# EAGLE design ASL2002 (EAGLE 6.3)
DATABASE: ./../../../../../Components/TinyCircuits_Part_Database.txt
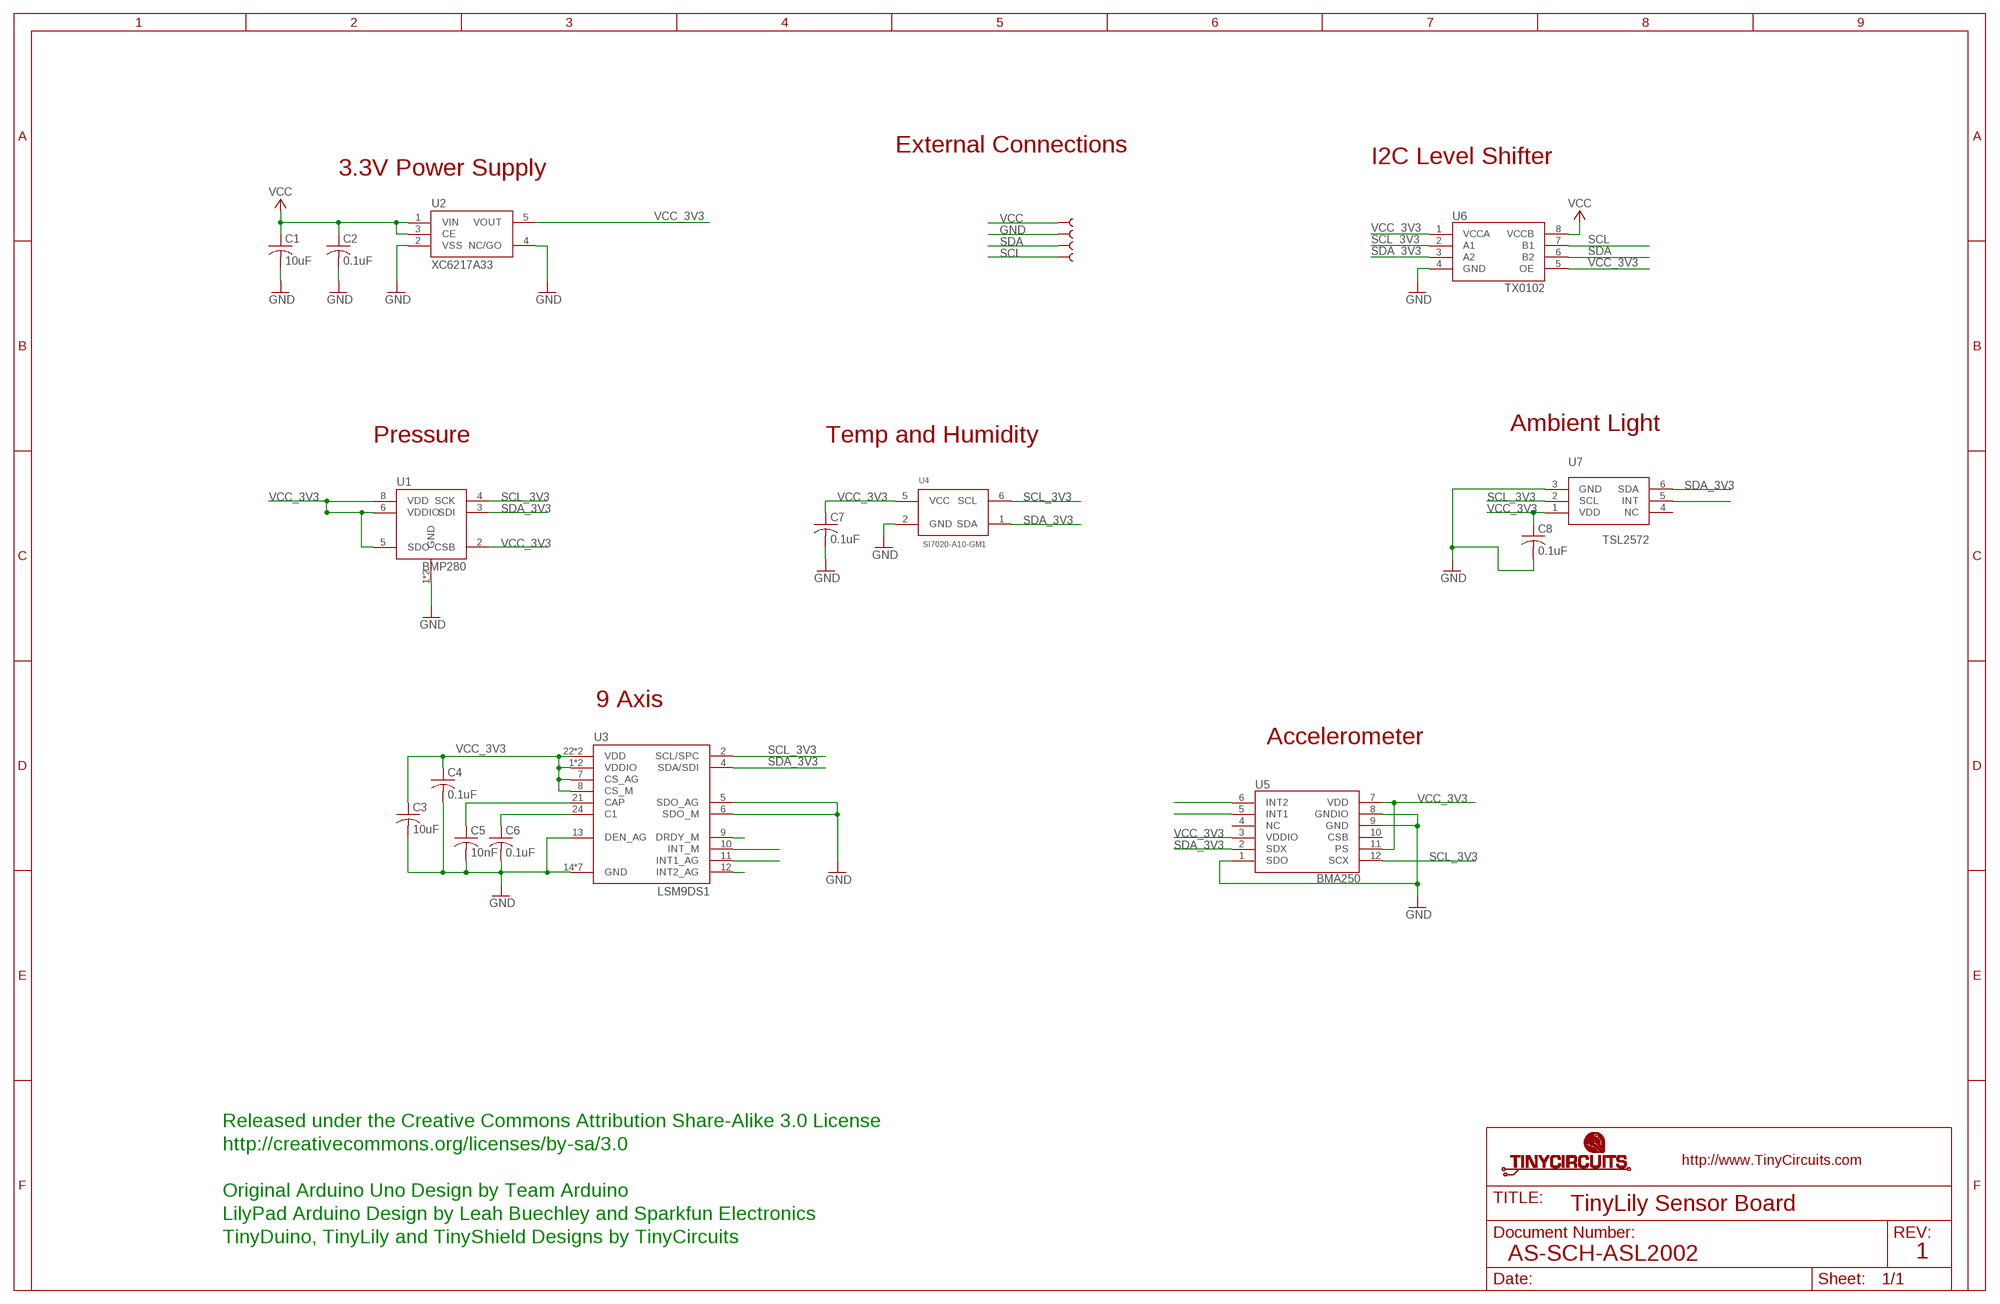
[diagram p0: schematic, sheet 1]

## Parts
$1  SEWTAB  [SEWTAP_TH]
C1  10uF  AS-ITM-00002  [C0603]
C2  0.1uF  AS-ITM-00008  [C0402]
C3  10uF  AS-ITM-00002  [C0603]
C4  0.1uF  AS-ITM-00008  [C0402]
C5  10nF  AS-ITM-00084  [C0402]
C6  0.1uF  AS-ITM-00008  [C0402]
C7  0.1uF  AS-ITM-00008  [C0402]
C8  0.1uF  AS-ITM-00008  [C0402]
U1  BMP280  AS-ITM-00264  [BMP280]
U2  XC6217A33  AS-ITM-00249  [SOT-25]
U3  LSM9DS1  AS-ITM-00265  [LGA-24]
U4  SI7020-A10-GM1  AS-ITM-00218  [DFN6]
U5  BMA250  AS-ITM-00070  [3-AXIS_ACCELEROMETER]
U6  TX0102  AS-ITM-00073  [DQE(R-PX2SON-N8)]
U7  TSL2572  AS-ITM-00116  [TSL2572]
U$1  SEWTAB  [SEWTAP_TH]
U$2  SEWTAB  [SEWTAP_TH]
U$3  SEWTAB  [SEWTAP_TH]

## Nets
GND: C1.2 C2.2 C3.2 C4.2 C5.2 C6.2 C7.2 C8.2 U1.1(GND) U1.7(GND) U2.2(VSS) U2.4(NC/GO) U3.5(SDO_AG) U3.6(SDO_M) U3.13(DEN_AG) U3.14(GND) U3.15(GND) U3.16(GND) U3.17(GND) U3.18(GND) U3.19(GND) U3.20(GND) U4.2(GND) U5.1(SDO) U5.8(GNDIO) U5.9(GND) U6.4(GND) U7.3(GND) U$1.1
N$2: C5.1 U3.21(CAP)
N$6: C6.1 U3.24(C1)
N$10: U7.5(INT)
N$11: U3.9(DRDY_M)
N$14: U5.5(INT1)
N$15: U5.6(INT2)
N$17: U3.10(INT_M)
N$18: U3.11(INT1_AG)
N$19: U3.12(INT2_AG)
SCL: U6.7(B1) U$3.1
SCL_3V3: U1.4(SCK) U3.2(SCL/SPC) U4.6(SCL) U5.12(SCX) U6.2(A1) U7.2(SCL)
SDA: U6.6(B2) U$2.1
SDA_3V3: U1.3(SDI) U3.4(SDA/SDI) U4.1(SDA) U5.2(SDX) U6.3(A2) U7.6(SDA)
VCC: $1.1 C1.1 C2.1 U2.1(VIN) U2.3(CE) U6.8(VCCB)
VCC_3V3: C3.1 C4.1 C7.1 C8.1 U1.2(CSB) U1.5(SDO) U1.6(VDDIO) U1.8(VDD) U2.5(VOUT) U3.1(VDDIO) U3.3(VDDIO) U3.7(CS_AG) U3.8(CS_M) U3.22(VDD) U3.23(VDD) U4.5(VCC) U5.3(VDDIO) U5.7(VDD) U5.11(PS) U6.1(VCCA) U6.5(OE) U7.1(VDD)
Unconnected: U5.4(NC) U5.10(CSB) U7.4(NC)

## Notes on the sheet
- External Connections
- I2C Level Shifter
- 3.3V Power Supply
- Ambient Light
- Pressure | Temp and Humidity
- 9 Axis
- Accelerometer
- Released under the Creative Commons Attribution Share-Alike 3.0 License
- http://creativecommons.org/licenses/by-sa/3.0
- Original Arduino Uno Design by Team Arduino
- TinyLily Sensor Board
- LilyPad Arduino Design by Leah Buechley and Sparkfun Electronics
- TinyDuino, TinyLily and TinyShield Designs by TinyCircuits
- AS-SCH-ASL2002 | 1

## Library data of the parts
$1 U$1-U$3 = tinycircuits:SEWTAB: TinyLily Sew Tab; BOM: EXCLUDE; DNP: T
C1 C3 = tinycircuits:AS-ITM-00002: CAP CER 10UF 10V 20% X5R 0603; PARTNO: AS-ITM-00002
C2 C4 C6-C8 = tinycircuits:AS-ITM-00008: CAP CER 0.1UF 16V 10% X5R 0402; PARTNO: AS-ITM-00008
C5 = tinycircuits:AS-ITM-00084: CAP CER 10NF 25V 10% X7R 0402; PARTNO: AS-ITM-00084
U1 = tinycircuits:AS-ITM-00264: Board Mount Pressure Sensors Digital Barometer 2.7uA, 300-1200hPa; PARTNO: AS-ITM-00264
U2 = tinycircuits:AS-ITM-00249: IC REG LDO 3.3V 0.2A SOT25; PARTNO: AS-ITM-00249
U3 = tinycircuits:AS-ITM-00265: 9 AXIS ACCEL GYRO MAG 3D INEMO 24TFLGA; PARTNO: AS-ITM-00265
U4 = tinycircuits:AS-ITM-00218: IC HUMIDITY TEMPERATURE I2C DFN-6; PARTNO: AS-ITM-00218
U5 = tinycircuits:AS-ITM-00070: 3-AXIS ACCELEROMOETER; PARTNO: AS-ITM-00070
U6 = tinycircuits:AS-ITM-00073: TI 2-Bit Bidirectional Voltage-Level Translator; PARTNO: AS-ITM-00073; VALUE: TXS0102
U7 = tinycircuits:AS-ITM-00116: Light-To-Digital Converter, TSL2572; PARTNO: AS-ITM-00116

## Board
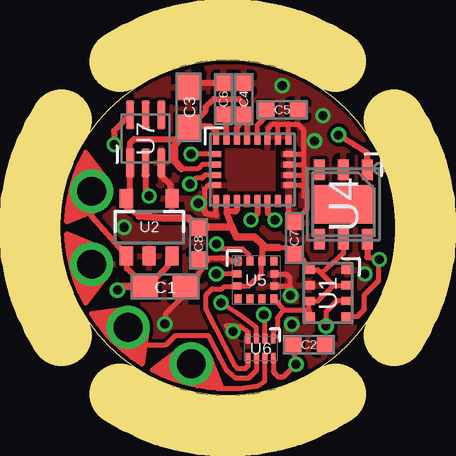
[diagram p1: board, top side]
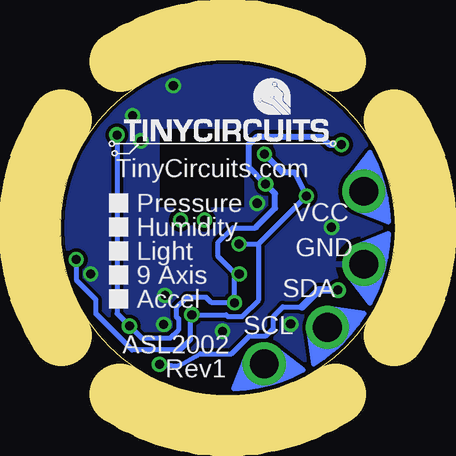
[diagram p2: board, bottom side, seen from below]

Size 14 x 14 mm. Coordinates in mm from the lower left corner, seen from the top.
Outline: 0,7 arc-180 14,7 arc-180 0,7
Copper layers (1*16): Top 0.035mm / dielectric 1.5mm / Bottom 0.035mm
Design rules "default *": minimum track width 7mil, minimum drill 15mil, track to track 6mil, track to pad 6mil, pad to pad 6mil, via to via 6mil, smd to smd 6mil, copper to edge 6mil, drill to drill 8mil, minimum pad ring 8mil, minimum via ring 5mil, stop-mask expansion 4mil, vias tented up to drill 25mil, thermal gap 10mil
tRestrict: 13 lines
bRestrict: area 6.3,7.9 to 9.8,11.1
Milling: 4 lines

### Footprints (pad centres in the part's own frame; a part is rotated, then mirrored left to right if it is on the bottom)
SEWTAP_TH = drill 1.2 pad 1.803: 1 -0.127,0
C0603 = smd 1.1 x 1: 1 -0.85,0; 2 0.85,0
C0402 = smd 0.65 x 0.6: 1 -0.65,0; 2 0.65,0
BMP280 = smd 0.5 x 0.35: 1 0.8,0.975; 2 0.8,0.325; 3 0.8,-0.325; 4 0.8,-0.975; 5 -0.8,-0.975; 6 -0.8,-0.325; 7 -0.8,0.325; 8 -0.8,0.975
SOT-25 = smd 0.55 x 0.8: 1 -0.95,-1.2; 2 0,-1.2; 3 0.95,-1.2; 4 0.95,1.2; 5 -0.95,1.2
LGA-24 = smd 0.25 x 0.5: 1 -1.505,1.3; 6 -1.505,-1.3; 7 -1.075,-1.3; 8 -0.645,-1.3; 9 -0.215,-1.3; 10 0.215,-1.3; 11 0.645,-1.3; 12 1.075,-1.3; 13 1.505,-1.3; 18 1.505,1.3; 19 1.075,1.3; 20 0.645,1.3; 21 0.215,1.3; 22 -0.215,1.3; 23 -0.645,1.3; 24 -1.075,1.3 | smd 0.5 x 0.25: 2 -1.55,0.645; 3 -1.55,0.215; 4 -1.55,-0.215; 5 -1.55,-0.645; 14 1.55,-0.645; 15 1.55,-0.215; 16 1.55,0.215; 17 1.55,0.645
DFN6 = smd 0.85 x 0.45: 1 -1.45,1; 2 -1.45,0; 3 -1.45,-1; 4 1.45,-1; 5 1.45,0; 6 1.45,1 | smd 1.6 x 2.5: PAD 0,0
3-AXIS_ACCELEROMETER = smd 0.3 x 0.35: 1 -0.75,0.775; 4 -0.75,-0.775; 5 -0.25,-0.775; 6 0.25,-0.775; 7 0.75,-0.775; 10 0.75,0.775; 11 0.25,0.775; 12 -0.25,0.775 | smd 0.35 x 0.3: 2 -0.775,0.25; 3 -0.775,-0.25; 8 0.775,-0.25; 9 0.775,0.25
DQE(R-PX2SON-N8) = smd 0.2 x 0.4: 1 -0.525,-0.4; 2 -0.175,-0.4; 3 0.175,-0.4; 4 0.525,-0.4; 5 0.525,0.4; 6 0.175,0.4; 7 -0.175,0.4; 8 -0.525,0.4
TSL2572 = smd 1.2 x 0.35: 1 -1,0.65; 2 -1,0; 3 -1,-0.65; 4 1,-0.65; 5 1,0; 6 1,0.65

### Placement (x,y rotation side)
$1  1.45,8.49 345 top
C1  4.39,4.54 0 top
C2  10.39,2.12 0 top
C3  5.37,12.02 90 top
C4  7.67,12.37 90 top
C5  9.27,11.92 0 top
C6  6.82,12.37 90 top
C7  9.78,6.57 90 top
C8  5.78,6.33 270 top
U1  11.18,4.27 0 top
U2  3.72,7.02 0 top
U3  8.02,9.42 0 top
U4  11.82,7.97 270 top
U5  8.17,4.82 0 top
U6  8.37,1.97 180 top
U7  3.57,10.71 90 top
U$1  1.45,5.51 15 top
U$2  2.93,2.93 45 top
U$3  5.51,1.45 75 top
U$6  [DOCFIELD-TINYCIRCUITS-PCB]  31,-13 0 top  (outside the outline)

### Tracks (layer width: path | path; a pad name or v marks a point on that pad's centre or on a via)
GND  (via drill 0.38)
  Top 0.2: U6.4 7.85,2.65 7.52,2.87
  Top 0.203: U5.8 9.53,4.57 9.6,4.5 v9.62,4.17 9.6,4.9 9.43,5.07 U5.9 | U5.1 7.2,5.6 6.92,5.72 6.22,5.72 5.82,5.12 C1.2 5.24,4.24 4.4,3.4 4.4,2.81 v4.37,2.98 | 5.72,13.02 C3.2 | U3.5 6.18,8.78 6.02,8.62 6.02,7.77 6.12,7.57 6.52,7.52 6.52,7.67 U3.6 | U3.20 8.67,11.12 8.87,11.32 9.12,11.32 | 9.12,11.32 9.57,11.32 | 9.57,11.32 9.92,11.32 10.17,11.07 10.17,10.12 10.12,10.07 U3.17 10.17,10.07 10.17,9.62 | U3.19 9.1,11.3 9.12,11.32 | U3.18 9.53,11.28 9.57,11.32 | 10.17,9.62 10.17,9.17 | 10.17,9.17 10.17,8.72 | 10.17,8.72 10.17,8.32 | U3.16 10.16,9.64 10.17,9.62 | U3.15 10.14,9.21 10.17,9.17 | 10.17,8.72 10.12,8.78 U3.14 10.12,8.78 10.3,8.6 10.3,7.79 C7.2 9.53,7.62 U3.13 | 7.52,2.87 6.93,2.92 v7.22,2.68
  Top 0.254: v5.77,8.02 6.07,7.62 6.52,7.52 | C6.2 5.8,13.02 arc45 5.58,12.93 C3.2 | U7.3 4.23,9.18 4.6,8.8 4.6,8.3 U2.4
  other vias: 9.27,12.92 10.62,10.62 10.97,11.67 2.67,7.02 9.67,2.97 12.72,5.07
  pour Bottom: 14,7 arc180 0,7 arc180
  pour Top: 14,7 arc180 0,7 arc180
N$2
  Top 0.203: U3.21 8.24,11.29 8.52,11.57 C5.1
N$6
  Top 0.203: 6.95,11.55 C6.1
  Top 0.254: U3.24 6.95,11.55
N$17  (via drill 0.38)
  Top 0.254: U3.10 8.24,7.59 v7.97,7.32
N$18  (via drill 0.38)
  Top 0.254: U3.11 8.67,7.63 v8.97,7.32
SCL
  Top 0.2: 8.55,0.6 U6.7
  Top 0.203: U$3.1 5.57,1.33 6.6,0.3 7.5,0.3 8.25,0.4 8.55,0.6
SCL_3V3  (via drill 0.38)
  Top 0.2: U6.2 8.55,3.05 8.57,3.22
  Top 0.203: U5.12 7.92,5.82 7.62,6.12 6.73,6.12 v6.53,6.32 | U3.2 5.53,10.07 v5.47,10.07 | U1.4 12.4,3.3 12.7,3.6 12.7,4.2 13.3,4.8 13.3,5.65 v13.32,5.67
  Top 0.254: 8.57,3.22 v8.5,3.37 | U4.6 12.82,5.77 v13.32,5.67 | U7.2 3.57,8.47 v3.72,8.32
  Bottom 0.203: v13.32,5.67 13.3,5.65 13.3,4.8 12.5,4 12.5,3.4 11,1.9 9,1.9 8.55,2.35 8.55,3.33 v8.5,3.37 7.07,3.37 7,3.3 6.4,3.3 5.7,4 5.7,6.34 | 5.7,6.34 v3.72,8.32 | v6.53,6.32 5.72,6.32 5.7,6.34
  Bottom 0.254: v5.47,10.07 4.72,9.32 4.22,9.32 v3.72,8.32
SDA
  Top 0.2: U6.6 8.2,1.05 7.87,0.72
  Top 0.203: 7.87,0.72 7.33,0.72 6.95,1.05 6.2,2.5 4.8,2.5 4.4,2.1 3.58,2.1 U$2.1
SDA_3V3  (via drill 0.38)
  Top 0.2: U6.3 8.2,2.85 7.45,3.4
  Top 0.203: U5.2 v6.52,5.07 | U3.4 6.06,9.21 5.92,9.07 5.67,9.07 v5.42,8.82 | 7.45,3.4 v6.72,3.87 | U1.3 11.55,3.95 11.1,3.5 v11.1,2.9
  Top 0.254: U4.1 12.82,10.12 v11.62,10.87 | U7.6 2.26,11.04 v2.26,10.47
  Bottom 0.203: v11.62,10.87 11.62,3.42 v11.1,2.9 10.6,2.4 9.4,2.4 9.05,2.75 9.05,3.2 9.15,3.3 9.15,3.65 8.7,4.1 7.9,4.1 7.67,3.87 v6.72,3.87 6.72,4.87 v6.52,5.07 6.67,5.07 7.4,5.8 7.4,6.4 6.8,7 5.84,7 5.82,7.02
  Bottom 0.254: 5.82,7.02 5.02,7.82 5.02,8.42 v5.42,8.82 6.12,9.52 6.12,10.47 5.79,10.8 3.1,10.8 2.77,10.47 v2.26,10.47
VCC  (via drill 0.38)
  Top 0.2: U6.8 8.9,1 9.12,0.77
  Top 0.203: C1.1 3.54,4.56 | 2.8,5.8 U2.1 | 9.12,0.77 9.32,0.77 v9.85,1.3 9.7,1.98 C2.1
  Top 0.254: C1.1 3.74,4.64 4.5,5.4 4.5,5.65 U2.3 | 3.54,4.56 2.8,5.3 2.8,5.8 | U2.1 1.33,7.47 $1.1
  Top 0.305: v2.4,4.4 2.54,4.54 C1.1
  Bottom 0.203: v9.85,1.3 9.05,1.25 8.15,1.75 6.85,1.75 6.1,2.5 5.4,2.5 5.1,2.8 5.1,3.3 4.7,3.7 3.9,3.7
  Bottom 0.305: 3.9,3.7 3.2,4.4 v2.4,4.4
VCC_3V3
  Top 0.2: 9.07,2.82 8.9,2.71 U6.1 | U6.5 7.85,1.25 7.72,1.12 7.42,1.12
  Top 0.203: U5.7 9.32,3.57 | 9.32,3.57 10.41,3.57 U1.5 U1.6 10.75,3.95 11.4,4.6 | 7.67,11.57 C4.1 7.86,11.54 7.81,11.39 | U3.1 6.52,10.78 6.52,11.07 6.52,11.03 | 5.62,11.22 C3.1 | U3.3 5.94,9.64 5.77,9.47 5.07,9.47 | 9.07,2.82 9.07,3.22 9.32,3.57 | 9.12,6.17 9.48,6.17 C7.1 10.01,5.92 U1.8 10.75,5.25 10.9,5.1 | 10.9,5.1 11.4,4.6 | 11.4,4.6 U1.2 | U4.5 11.82,5.92 10.9,5.1 | C8.1 5.78,6.9 5.7,7.02 | 3.3,7.5 2.78,7.82 U2.5 | U5.11 8.4,5.58 8.4,5.1 7.87,4.57 U5.3 7.37,4.55 6.85,4.55 6.75,4.45 6.35,4.45 6.1,4.2 6.1,3.6 7.28,1.27 7.42,1.12
  Top 0.254: 8.42,6.32 U5.11 | U3.23 7.38,11.18 7.67,11.57 | C4.1 7.67,12.17 7.47,12.37 6.42,12.37 6.07,12.02 6.07,11.87 C3.1 4.9,10.7 3.1,10.7 2.93,10.52 U7.1 2.93,8.38 U2.5 | 7.81,11.39 U3.22 | U3.1 6.52,11.03 6.27,11.22 5.62,11.22 | U3.7 6.95,7.62 | 6.95,7.62 7.25,6.85 7.17,7.02 | U3.8 7.38,7.73 7.32,7.67 7,7.67 6.95,7.62
  Top 0.305: 9.12,6.17 8.57,6.17 8.42,6.32 8.12,6.62 7.37,6.62 7.17,7.02 5.7,7.02 | 5.07,9.47 4.77,9.77 4.77,10.42 5.04,10.75 C3.1 | 3.3,7.5 4.3,7.4 5.36,7.4 C8.1

### Text on the board
bPlace: TinyCircuits.com | Pressure | VCC | Humidity | GND | Light | 9 Axis | SDA | Accel | SCL | ASL2002 | Rev1
Document: FABRICATION DRAWING | NOTES: | 1. PRINTED CIRCUIT BOARD MADE FROM NEMA GRADE FR-4 EPOXY LAMINATE | WITH 1 OUNCE COPPER PLATING AND .024 THICKNESS. | 2. ALL DIMENSIONS ARE GIVEN IN INCHES. | 3. CIRCUIT PATHS ARE FOR REFERENCE ONLY. | 4. HOLE SIZES SHOWN ARE FINISHED DIAMETERS AFTER PLATING. | 5. BOARD PLATED USING REFLOW OR SIMILAR METHOD. | 6. BOARD TO HAVE BLUE SOLDER MASK ON PLATED SURFACES USING WET FILM | 7. SILKSCREEN BOARD USING WHITE INK. | SR100 OR SR1010 EPOXY. EQUIVALENT WET OR DRY FILM MAY BE USED. | 8. THE FOLLOWING INFORMATION APPLIES TO THIS BOARD: | * 2 COPPER LAYERS | * .024 BOARD THICKNESS | * REQUIRES TOP SIDE SILKSCREEN | Released under the Creative Commons Attribution Share-Alike 3.0 License | http://creativecommons.org/licenses/by-sa/3.0 | LilyPad Arduino Design by Leah Buechley and Sparkfun Electronics | Original Arduino Uno Design by Team Arduino | TinyDuino, TinyLily and TinyShield Designs by TinyCircuits | TinyLily Sensor Board | AS-PCB-ASL2002 | 1